# Altium schematic sheet FPGA_IO.SchDoc
size A3
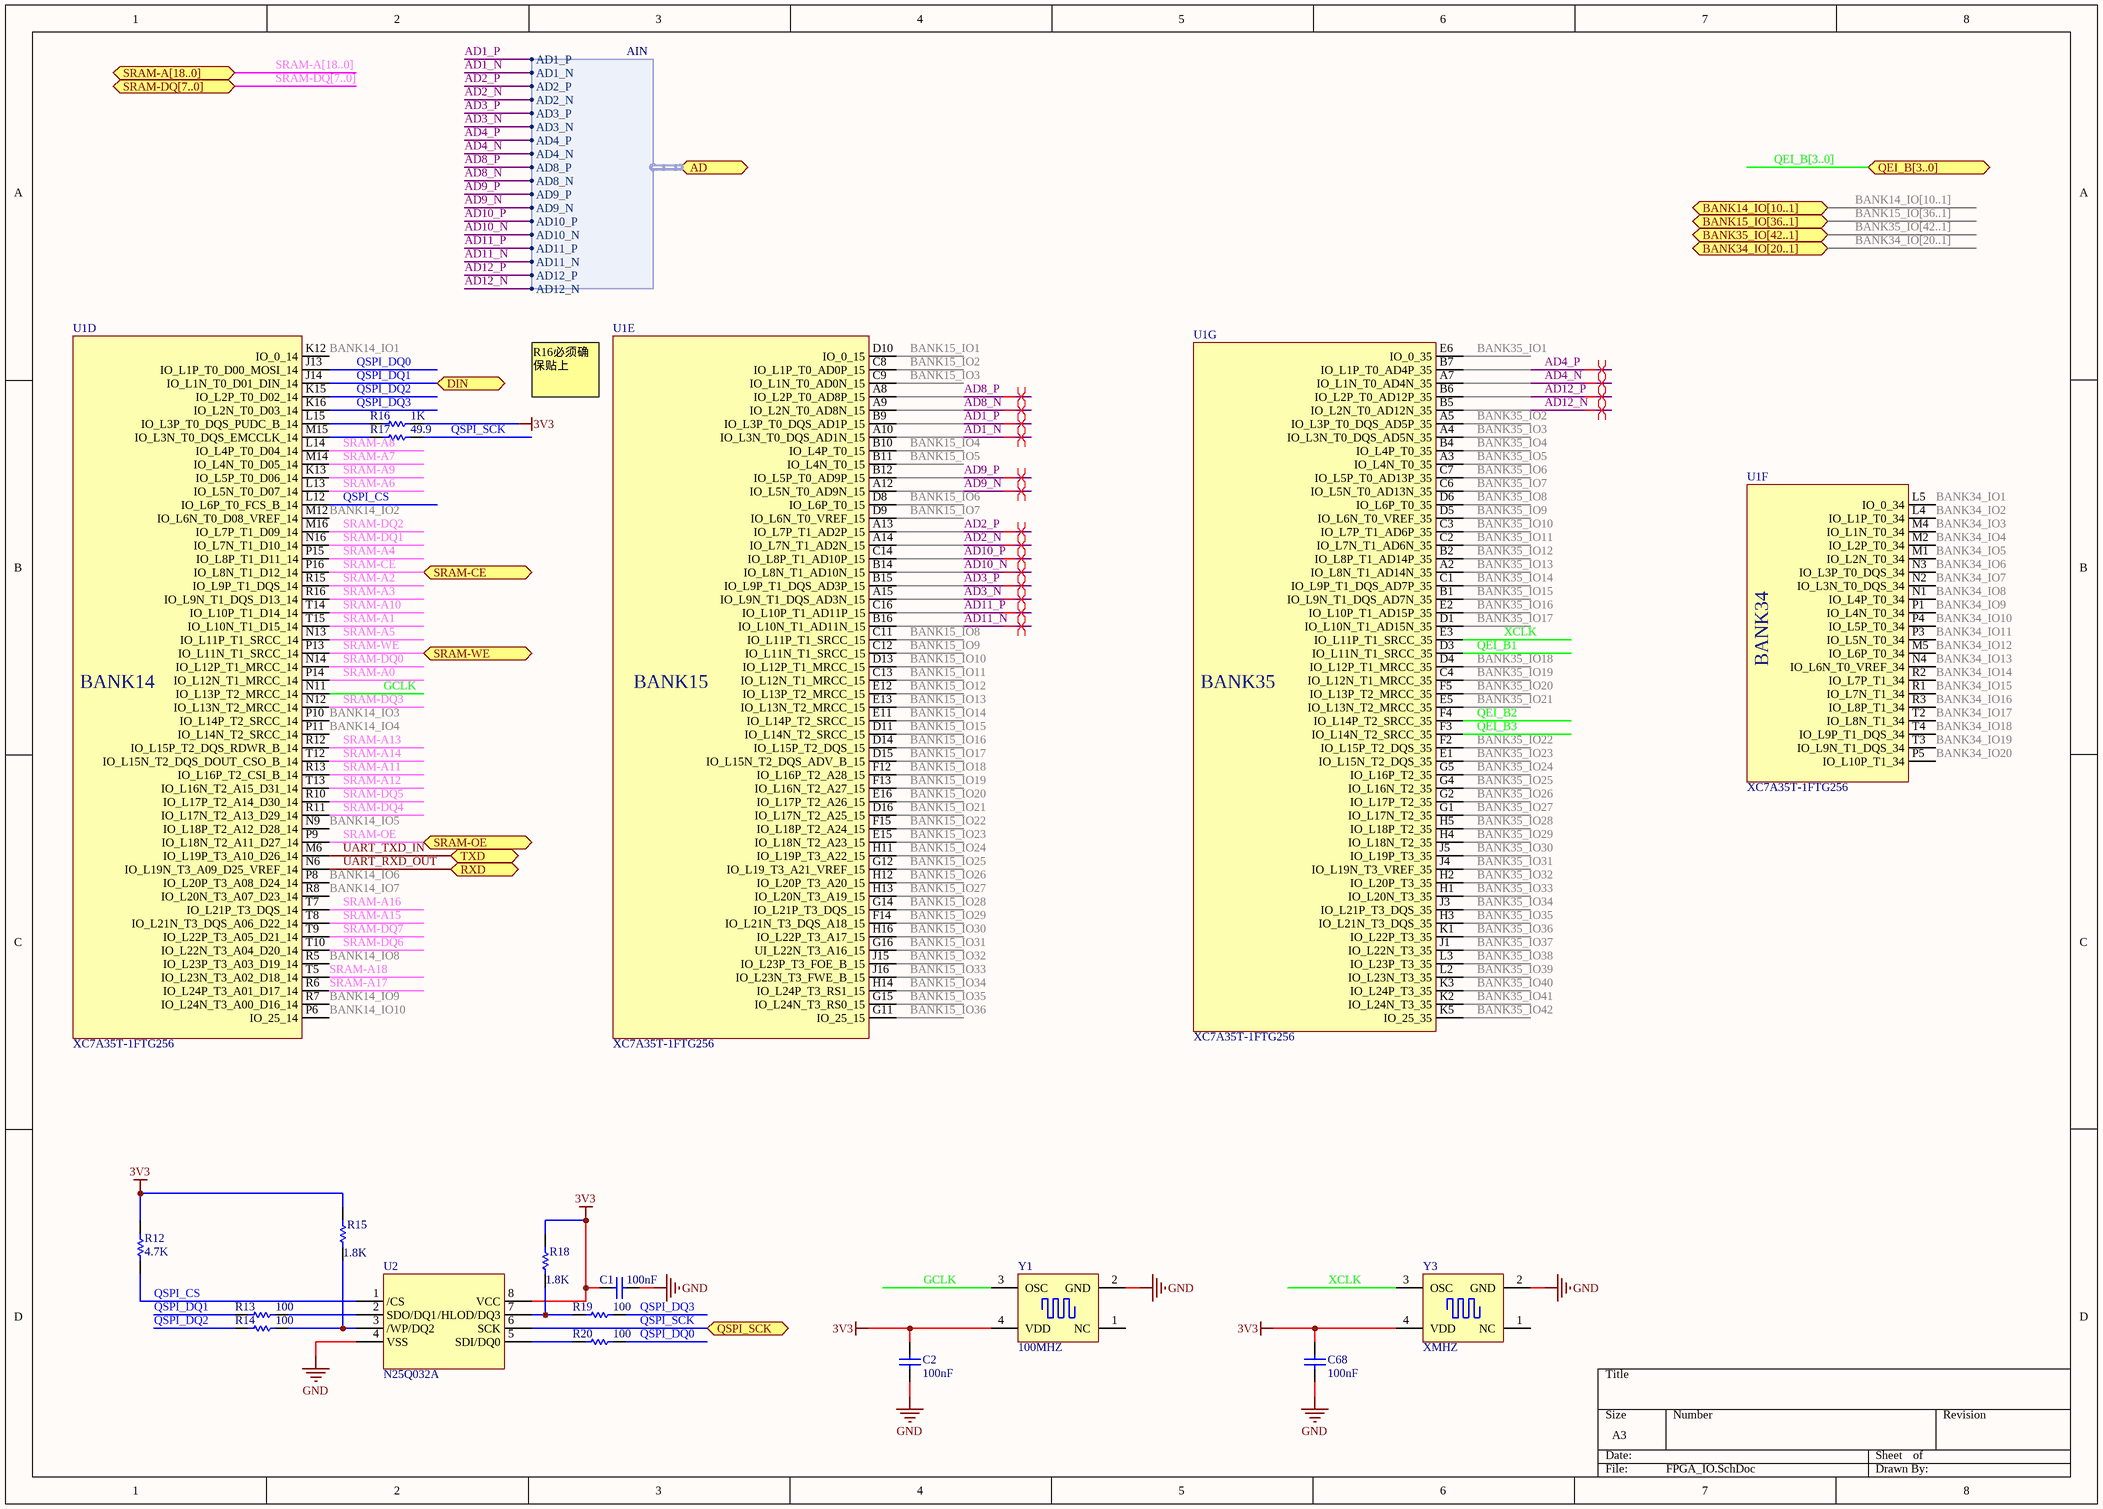
[diagram p0: FPGA_IO.SchDoc]

## Parts
C1  value 100nF  [1608[0603]]  (hidden comment: Cap)
C2  value 100nF  [1608[0603]]  (hidden comment: Cap)
C68  value 100nF  [1608[0603]]  (hidden comment: Cap)
R12  value 4.7K  [1608[0603]]  (hidden comment: Res)
R13  value 100  [1608[0603]]  (hidden comment: Res)
R14  value 100  [1608[0603]]  (hidden comment: Res)
R15  value 1.8K  [1608[0603]]  (hidden comment: Res)
R16  value 1K  [1608[0603]]  (hidden comment: Res)
R17  value 49.9  [R2012]  (hidden comment: Res)
R18  value 1.8K  [1608[0603]]  (hidden comment: Res)
R19  value 100  [1608[0603]]  (hidden comment: Res)
R20  value 100  [1608[0603]]  (hidden comment: Res)
U1  XC7A35T-1FTG256  [BGA100P9X9-81A]  (parts D,E,F,G of 7)
U2  N25Q032A  [QFN127P500X600X100_HS-9N]
Y1  100MHZ  [XTAL7_3225]
Y3  XMHZ  [XTAL7_3225]

## Ports
AD (harness AIN), BANK14_IO[10..1], BANK15_IO[36..1], BANK34_IO[20..1], BANK35_IO[42..1], DIN, QEI_B[3..0], QSPI_SCK, RXD, SRAM-A[18..0], SRAM-CE, SRAM-DQ[7..0], SRAM-OE, SRAM-WE, TXD

## Harnesses
AIN: AD1_P, AD1_N, AD2_P, AD2_N, AD3_P, AD3_N, AD4_P, AD4_N, AD8_P, AD8_N, AD9_P, AD9_N, AD10_P, AD10_N, AD11_P, AD11_N, AD12_P, AD12_N

## Nets
3V3: C1.1 C2.2 C68.2 R12.1 R15.1 R16.1 R18.1 U2.8(VCC) Y1.4(VDD) Y3.4(VDD)
GND: C1.2 C2.1 C68.1 U2.4(VSS) Y1.2(GND) Y3.2(GND)
AD1_N: U1.A10(IO_L3N_T0_DQS_AD1N_15) ; port AD.AD1_N
AD1_P: U1.B9(IO_L3P_T0_DQS_AD1P_15) ; port AD.AD1_P
AD2_N: U1.A14(IO_L7N_T1_AD2N_15) ; port AD.AD2_N
AD2_P: U1.A13(IO_L7P_T1_AD2P_15) ; port AD.AD2_P
AD3_N: U1.A15(IO_L9N_T1_DQS_AD3N_15) ; port AD.AD3_N
AD3_P: U1.B15(IO_L9P_T1_DQS_AD3P_15) ; port AD.AD3_P
AD4_N: U1.A7(IO_L1N_T0_AD4N_35) ; port AD.AD4_N
AD4_P: U1.B7(IO_L1P_T0_AD4P_35) ; port AD.AD4_P
AD8_N: U1.A9(IO_L2N_T0_AD8N_15) ; port AD.AD8_N
AD8_P: U1.A8(IO_L2P_T0_AD8P_15) ; port AD.AD8_P
AD9_N: U1.A12(IO_L5N_T0_AD9N_15) ; port AD.AD9_N
AD9_P: U1.B12(IO_L5P_T0_AD9P_15) ; port AD.AD9_P
AD10_N: U1.B14(IO_L8N_T1_AD10N_15) ; port AD.AD10_N
AD10_P: U1.C14(IO_L8P_T1_AD10P_15) ; port AD.AD10_P
AD11_N: U1.B16(IO_L10N_T1_AD11N_15) ; port AD.AD11_N
AD11_P: U1.C16(IO_L10P_T1_AD11P_15) ; port AD.AD11_P
AD12_N: U1.B5(IO_L2N_T0_AD12N_35) ; port AD.AD12_N
AD12_P: U1.B6(IO_L2P_T0_AD12P_35) ; port AD.AD12_P
BANK14_IO1: U1.K12(IO_0_14)
BANK14_IO2: U1.M12(IO_L6N_T0_D08_VREF_14)
BANK14_IO3: U1.P10(IO_L14P_T2_SRCC_14)
BANK14_IO4: U1.P11(IO_L14N_T2_SRCC_14)
BANK14_IO5: U1.N9(IO_L18P_T2_A12_D28_14)
BANK14_IO6: U1.P8(IO_L20P_T3_A08_D24_14)
BANK14_IO7: U1.R8(IO_L20N_T3_A07_D23_14)
BANK14_IO8: U1.R5(IO_L23P_T3_A03_D19_14)
BANK14_IO9: U1.R7(IO_L24N_T3_A00_D16_14)
BANK14_IO10: U1.P6(IO_25_14)
BANK15_IO1: U1.D10(IO_0_15)
BANK15_IO2: U1.C8(IO_L1P_T0_AD0P_15)
BANK15_IO3: U1.C9(IO_L1N_T0_AD0N_15)
BANK15_IO4: U1.B10(IO_L4P_T0_15)
BANK15_IO5: U1.B11(IO_L4N_T0_15)
BANK15_IO6: U1.D8(IO_L6P_T0_15)
BANK15_IO7: U1.D9(IO_L6N_T0_VREF_15)
BANK15_IO8: U1.C11(IO_L11P_T1_SRCC_15)
BANK15_IO9: U1.C12(IO_L11N_T1_SRCC_15)
BANK15_IO10: U1.D13(IO_L12P_T1_MRCC_15)
BANK15_IO11: U1.C13(IO_L12N_T1_MRCC_15)
BANK15_IO12: U1.E12(IO_L13P_T2_MRCC_15)
BANK15_IO13: U1.E13(IO_L13N_T2_MRCC_15)
BANK15_IO14: U1.E11(IO_L14P_T2_SRCC_15)
BANK15_IO15: U1.D11(IO_L14N_T2_SRCC_15)
BANK15_IO16: U1.D14(IO_L15P_T2_DQS_15)
BANK15_IO17: U1.D15(IO_L15N_T2_DQS_ADV_B_15)
BANK15_IO18: U1.F12(IO_L16P_T2_A28_15)
BANK15_IO19: U1.F13(IO_L16N_T2_A27_15)
BANK15_IO20: U1.E16(IO_L17P_T2_A26_15)
BANK15_IO21: U1.D16(IO_L17N_T2_A25_15)
BANK15_IO22: U1.F15(IO_L18P_T2_A24_15)
BANK15_IO23: U1.E15(IO_L18N_T2_A23_15)
BANK15_IO24: U1.H11(IO_L19P_T3_A22_15)
BANK15_IO25: U1.G12(IO_L19_T3_A21_VREF_15)
BANK15_IO26: U1.H12(IO_L20P_T3_A20_15)
BANK15_IO27: U1.H13(IO_L20N_T3_A19_15)
BANK15_IO28: U1.G14(IO_L21P_T3_DQS_15)
BANK15_IO29: U1.F14(IO_L21N_T3_DQS_A18_15)
BANK15_IO30: U1.H16(IO_L22P_T3_A17_15)
BANK15_IO31: U1.G16(UI_L22N_T3_A16_15)
BANK15_IO32: U1.J15(IO_L23P_T3_FOE_B_15)
BANK15_IO33: U1.J16(IO_L23N_T3_FWE_B_15)
BANK15_IO34: U1.H14(IO_L24P_T3_RS1_15)
BANK15_IO35: U1.G15(IO_L24N_T3_RS0_15)
BANK15_IO36: U1.G11(IO_25_15)
BANK34_IO1: U1.L5(IO_0_34)
BANK34_IO2: U1.L4(IO_L1P_T0_34)
BANK34_IO3: U1.M4(IO_L1N_T0_34)
BANK34_IO4: U1.M2(IO_L2P_T0_34)
BANK34_IO5: U1.M1(IO_L2N_T0_34)
BANK34_IO6: U1.N3(IO_L3P_T0_DQS_34)
BANK34_IO7: U1.N2(IO_L3N_T0_DQS_34)
BANK34_IO8: U1.N1(IO_L4P_T0_34)
BANK34_IO9: U1.P1(IO_L4N_T0_34)
BANK34_IO10: U1.P4(IO_L5P_T0_34)
BANK34_IO11: U1.P3(IO_L5N_T0_34)
BANK34_IO12: U1.M5(IO_L6P_T0_34)
BANK34_IO13: U1.N4(IO_L6N_T0_VREF_34)
BANK34_IO14: U1.R2(IO_L7P_T1_34)
BANK34_IO15: U1.R1(IO_L7N_T1_34)
BANK34_IO16: U1.R3(IO_L8P_T1_34)
BANK34_IO17: U1.T2(IO_L8N_T1_34)
BANK34_IO18: U1.T4(IO_L9P_T1_DQS_34)
BANK34_IO19: U1.T3(IO_L9N_T1_DQS_34)
BANK34_IO20: U1.P5(IO_L10P_T1_34)
BANK35_IO1: U1.E6(IO_0_35)
BANK35_IO2: U1.A5(IO_L3P_T0_DQS_AD5P_35)
BANK35_IO3: U1.A4(IO_L3N_T0_DQS_AD5N_35)
BANK35_IO4: U1.B4(IO_L4P_T0_35)
BANK35_IO5: U1.A3(IO_L4N_T0_35)
BANK35_IO6: U1.C7(IO_L5P_T0_AD13P_35)
BANK35_IO7: U1.C6(IO_L5N_T0_AD13N_35)
BANK35_IO8: U1.D6(IO_L6P_T0_35)
BANK35_IO9: U1.D5(IO_L6N_T0_VREF_35)
BANK35_IO10: U1.C3(IO_L7P_T1_AD6P_35)
BANK35_IO11: U1.C2(IO_L7N_T1_AD6N_35)
BANK35_IO12: U1.B2(IO_L8P_T1_AD14P_35)
BANK35_IO13: U1.A2(IO_L8N_T1_AD14N_35)
BANK35_IO14: U1.C1(IO_L9P_T1_DQS_AD7P_35)
BANK35_IO15: U1.B1(IO_L9N_T1_DQS_AD7N_35)
BANK35_IO16: U1.E2(IO_L10P_T1_AD15P_35)
BANK35_IO17: U1.D1(IO_L10N_T1_AD15N_35)
BANK35_IO18: U1.D4(IO_L12P_T1_MRCC_35)
BANK35_IO19: U1.C4(IO_L12N_T1_MRCC_35)
BANK35_IO20: U1.F5(IO_L13P_T2_MRCC_35)
BANK35_IO21: U1.E5(IO_L13N_T2_MRCC_35)
BANK35_IO22: U1.F2(IO_L15P_T2_DQS_35)
BANK35_IO23: U1.E1(IO_L15N_T2_DQS_35)
BANK35_IO24: U1.G5(IO_L16P_T2_35)
BANK35_IO25: U1.G4(IO_L16N_T2_35)
BANK35_IO26: U1.G2(IO_L17P_T2_35)
BANK35_IO27: U1.G1(IO_L17N_T2_35)
BANK35_IO28: U1.H5(IO_L18P_T2_35)
BANK35_IO29: U1.H4(IO_L18N_T2_35)
BANK35_IO30: U1.J5(IO_L19P_T3_35)
BANK35_IO31: U1.J4(IO_L19N_T3_VREF_35)
BANK35_IO32: U1.H2(IO_L20P_T3_35)
BANK35_IO33: U1.H1(IO_L20N_T3_35)
BANK35_IO34: U1.J3(IO_L21P_T3_DQS_35)
BANK35_IO35: U1.H3(IO_L21N_T3_DQS_35)
BANK35_IO36: U1.K1(IO_L22P_T3_35)
BANK35_IO37: U1.J1(IO_L22N_T3_35)
BANK35_IO38: U1.L3(IO_L23P_T3_35)
BANK35_IO39: U1.L2(IO_L23N_T3_35)
BANK35_IO40: U1.K3(IO_L24P_T3_35)
BANK35_IO41: U1.K2(IO_L24N_T3_35)
BANK35_IO42: U1.K5(IO_25_35)
GCLK: U1.N11(IO_L13P_T2_MRCC_14) Y1.3(OSC)
QEI_B1: U1.D3(IO_L11N_T1_SRCC_35)
QEI_B2: U1.F4(IO_L14P_T2_SRCC_35)
QEI_B3: U1.F3(IO_L14N_T2_SRCC_35)
QSPI_CS: R12.2 U1.L12(IO_L6P_T0_FCS_B_14) U2.1(/CS)
QSPI_DQ0: R20.1 U1.J13(IO_L1P_T0_D00_MOSI_14)
QSPI_DQ1: R13.2 U1.J14(IO_L1N_T0_D01_DIN_14) ; port DIN
QSPI_DQ2: R14.2 U1.K15(IO_L2P_T0_D02_14)
QSPI_DQ3: R19.1 U1.K16(IO_L2N_T0_D03_14)
QSPI_SCK: R17.1 U2.6(SCK) ; port QSPI_SCK
SRAM-A0: U1.P14(IO_L12N_T1_MRCC_14)
SRAM-A1: U1.T15(IO_L10N_T1_D15_14)
SRAM-A2: U1.R15(IO_L9P_T1_DQS_14)
SRAM-A3: U1.R16(IO_L9N_T1_DQS_D13_14)
SRAM-A4: U1.P15(IO_L8P_T1_D11_14)
SRAM-A5: U1.N13(IO_L11P_T1_SRCC_14)
SRAM-A6: U1.L13(IO_L5N_T0_D07_14)
SRAM-A7: U1.M14(IO_L4N_T0_D05_14)
SRAM-A8: U1.L14(IO_L4P_T0_D04_14)
SRAM-A9: U1.K13(IO_L5P_T0_D06_14)
SRAM-A10: U1.T14(IO_L10P_T1_D14_14)
SRAM-A11: U1.R13(IO_L16P_T2_CSI_B_14)
SRAM-A12: U1.T13(IO_L16N_T2_A15_D31_14)
SRAM-A13: U1.R12(IO_L15P_T2_DQS_RDWR_B_14)
SRAM-A14: U1.T12(IO_L15N_T2_DQS_DOUT_CSO_B_14)
SRAM-A15: U1.T8(IO_L21N_T3_DQS_A06_D22_14)
SRAM-A16: U1.T7(IO_L21P_T3_DQS_14)
SRAM-A17: U1.R6(IO_L24P_T3_A01_D17_14)
SRAM-A18: U1.T5(IO_L23N_T3_A02_D18_14)
SRAM-CE: U1.P16(IO_L8N_T1_D12_14) ; port SRAM-CE
SRAM-DQ0: U1.N14(IO_L12P_T1_MRCC_14)
SRAM-DQ1: U1.N16(IO_L7N_T1_D10_14)
SRAM-DQ2: U1.M16(IO_L7P_T1_D09_14)
SRAM-DQ3: U1.N12(IO_L13N_T2_MRCC_14)
SRAM-DQ4: U1.R11(IO_L17N_T2_A13_D29_14)
SRAM-DQ5: U1.R10(IO_L17P_T2_A14_D30_14)
SRAM-DQ6: U1.T10(IO_L22N_T3_A04_D20_14)
SRAM-DQ7: U1.T9(IO_L22P_T3_A05_D21_14)
SRAM-OE: U1.P9(IO_L18N_T2_A11_D27_14) ; port SRAM-OE
SRAM-WE: U1.P13(IO_L11N_T1_SRCC_14) ; port SRAM-WE
UART_RXD_OUT: U1.N6(IO_L19N_T3_A09_D25_VREF_14) ; port RXD
UART_TXD_IN: U1.M6(IO_L19P_T3_A10_D26_14) ; port TXD
XCLK: U1.E3(IO_L11P_T1_SRCC_35) Y3.3(OSC)
NetR13_1: R13.1 U2.2(SDO/DQ1)
NetR14_1: R14.1 R15.2 U2.3(/WP/DQ2)
NetR16_2: R16.2 U1.L15(IO_L3P_T0_DQS_PUDC_B_14)
NetR17_2: R17.2 U1.M15(IO_L3N_T0_DQS_EMCCLK_14)
NetR18_2: R18.2 R19.2 U2.7(/HLOD/DQ3)
NetR20_2: R20.2 U2.5(SDI/DQ0)

Not connected (* = marked no-connect by the designer): Y1 1(NC); Y3 1(NC)

## Buses and harness runs
bus BANK14_IO[10..1] = port BANK14_IO[10..1]
bus BANK15_IO[36..1] = port BANK15_IO[36..1]
bus BANK34_IO[20..1] = port BANK34_IO[20..1]
bus BANK35_IO[42..1] = port BANK35_IO[42..1]
bus QEI_B[3..0] = port QEI_B[3..0]
bus SRAM-A[18..0] = port SRAM-A[18..0]
bus SRAM-DQ[7..0] = port SRAM-DQ[7..0]

## Layout directives
differential pair: AD1_N, AD1_P, AD2_N, AD2_P, AD3_N, AD3_P, AD4_N, AD4_P, AD8_N, AD8_P, AD9_N, AD9_P, AD10_N, AD10_P, AD11_N, AD11_P, AD12_N, AD12_P

## Notes on the sheet
- R16必须确保贴上
- (in symbol XC7A35T-1FTG256, part D) BANK14
- (in symbol XC7A35T-1FTG256, part E) BANK15
- (in symbol XC7A35T-1FTG256, part F) BANK34
- (in symbol XC7A35T-1FTG256, part G) BANK35

## Library data of the parts
C1 C2 C68 = Cap: 贴片电容; Published: 8-Jun-2000; LatestRevisionDate: 17-Jul-2002; LatestRevisionNote: Re-released for DXP Platform.; PackageReference: RAD-0.3; Publisher: Altium Limited
R12-R20 = Res: 贴片电阻; Published: 8-Jun-2000; LatestRevisionDate: 17-Jul-2002; LatestRevisionNote: Re-released for DXP Platform.; PackageReference: AXIAL-0.3; Publisher: Altium Limited
Y1 Y3 = XTAL1